# Altium schematic sheet Misc.SchDoc
size A4
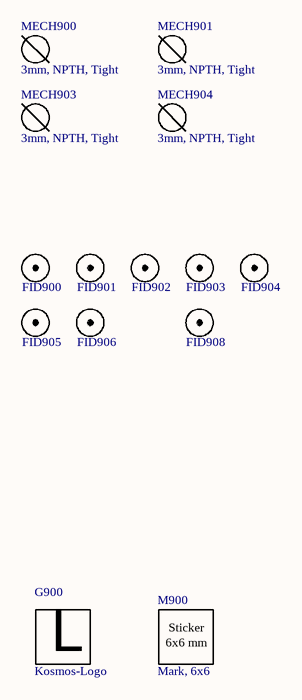
[diagram p0: Misc.SchDoc]

## Parts
FID900  FIDUCIAL ROUND 2,5MM  [FID100X300]  (value not drawn)  (no BOM)
FID901  FIDUCIAL ROUND 2,5MM  [FID100X300]  (value not drawn)  (no BOM)
FID902  FIDUCIAL ROUND 2,5MM  [FID100X300]  (value not drawn)  (no BOM)
FID903  FIDUCIAL ROUND 2,5MM  [FID100X300]  (value not drawn)  (no BOM)
FID904  FIDUCIAL ROUND 2,5MM  [FID100X300]  (value not drawn)  (no BOM)
FID905  FIDUCIAL ROUND 2,5MM  [FID100X300]  (value not drawn)  (no BOM)
FID906  FIDUCIAL ROUND 2,5MM  [FID100X300]  (value not drawn)  (no BOM)
FID908  FIDUCIAL ROUND 2,5MM  [FID100X300]  (value not drawn)  (no BOM)
G900  Kosmos-Logo  [KOSMOS_LOGO_S]  (no BOM)
M900  Mark, 6x6  [MARK_6X6_A]  (no BOM)
MECH900  3mm, NPTH, Tight  [MTGNP730H310P]  (no BOM)
MECH901  3mm, NPTH, Tight  [MTGNP730H310P]  (no BOM)
MECH903  3mm, NPTH, Tight  [MTGNP730H310P]  (no BOM)
MECH904  3mm, NPTH, Tight  [MTGNP730H310P]  (no BOM)

## Notes on the sheet
- (in symbol LOGO KOSMOS OVERLAY) L
- (in symbol STICKER MARK 6X6) Sticker; 6x6 mm

## Library data of the parts
FID900-FID906 FID908 = FIDUCIAL ROUND 2,5MM: Fiducial, Round, 1mm
G900 = LOGO KOSMOS OVERLAY: Kosmos-Logo-XL-Top-Overlay
M900 = STICKER MARK 6X6: Stick Mark, 6x6 mm,
MECH900 MECH901 MECH903 MECH904 = MH 3MM NPTH TIGHT: Mounting Hole, 3mm, Non-Plated, Tight-Fit